# EAGLE design Logic Engine - Front SK6812 (EAGLE 6.6.0)
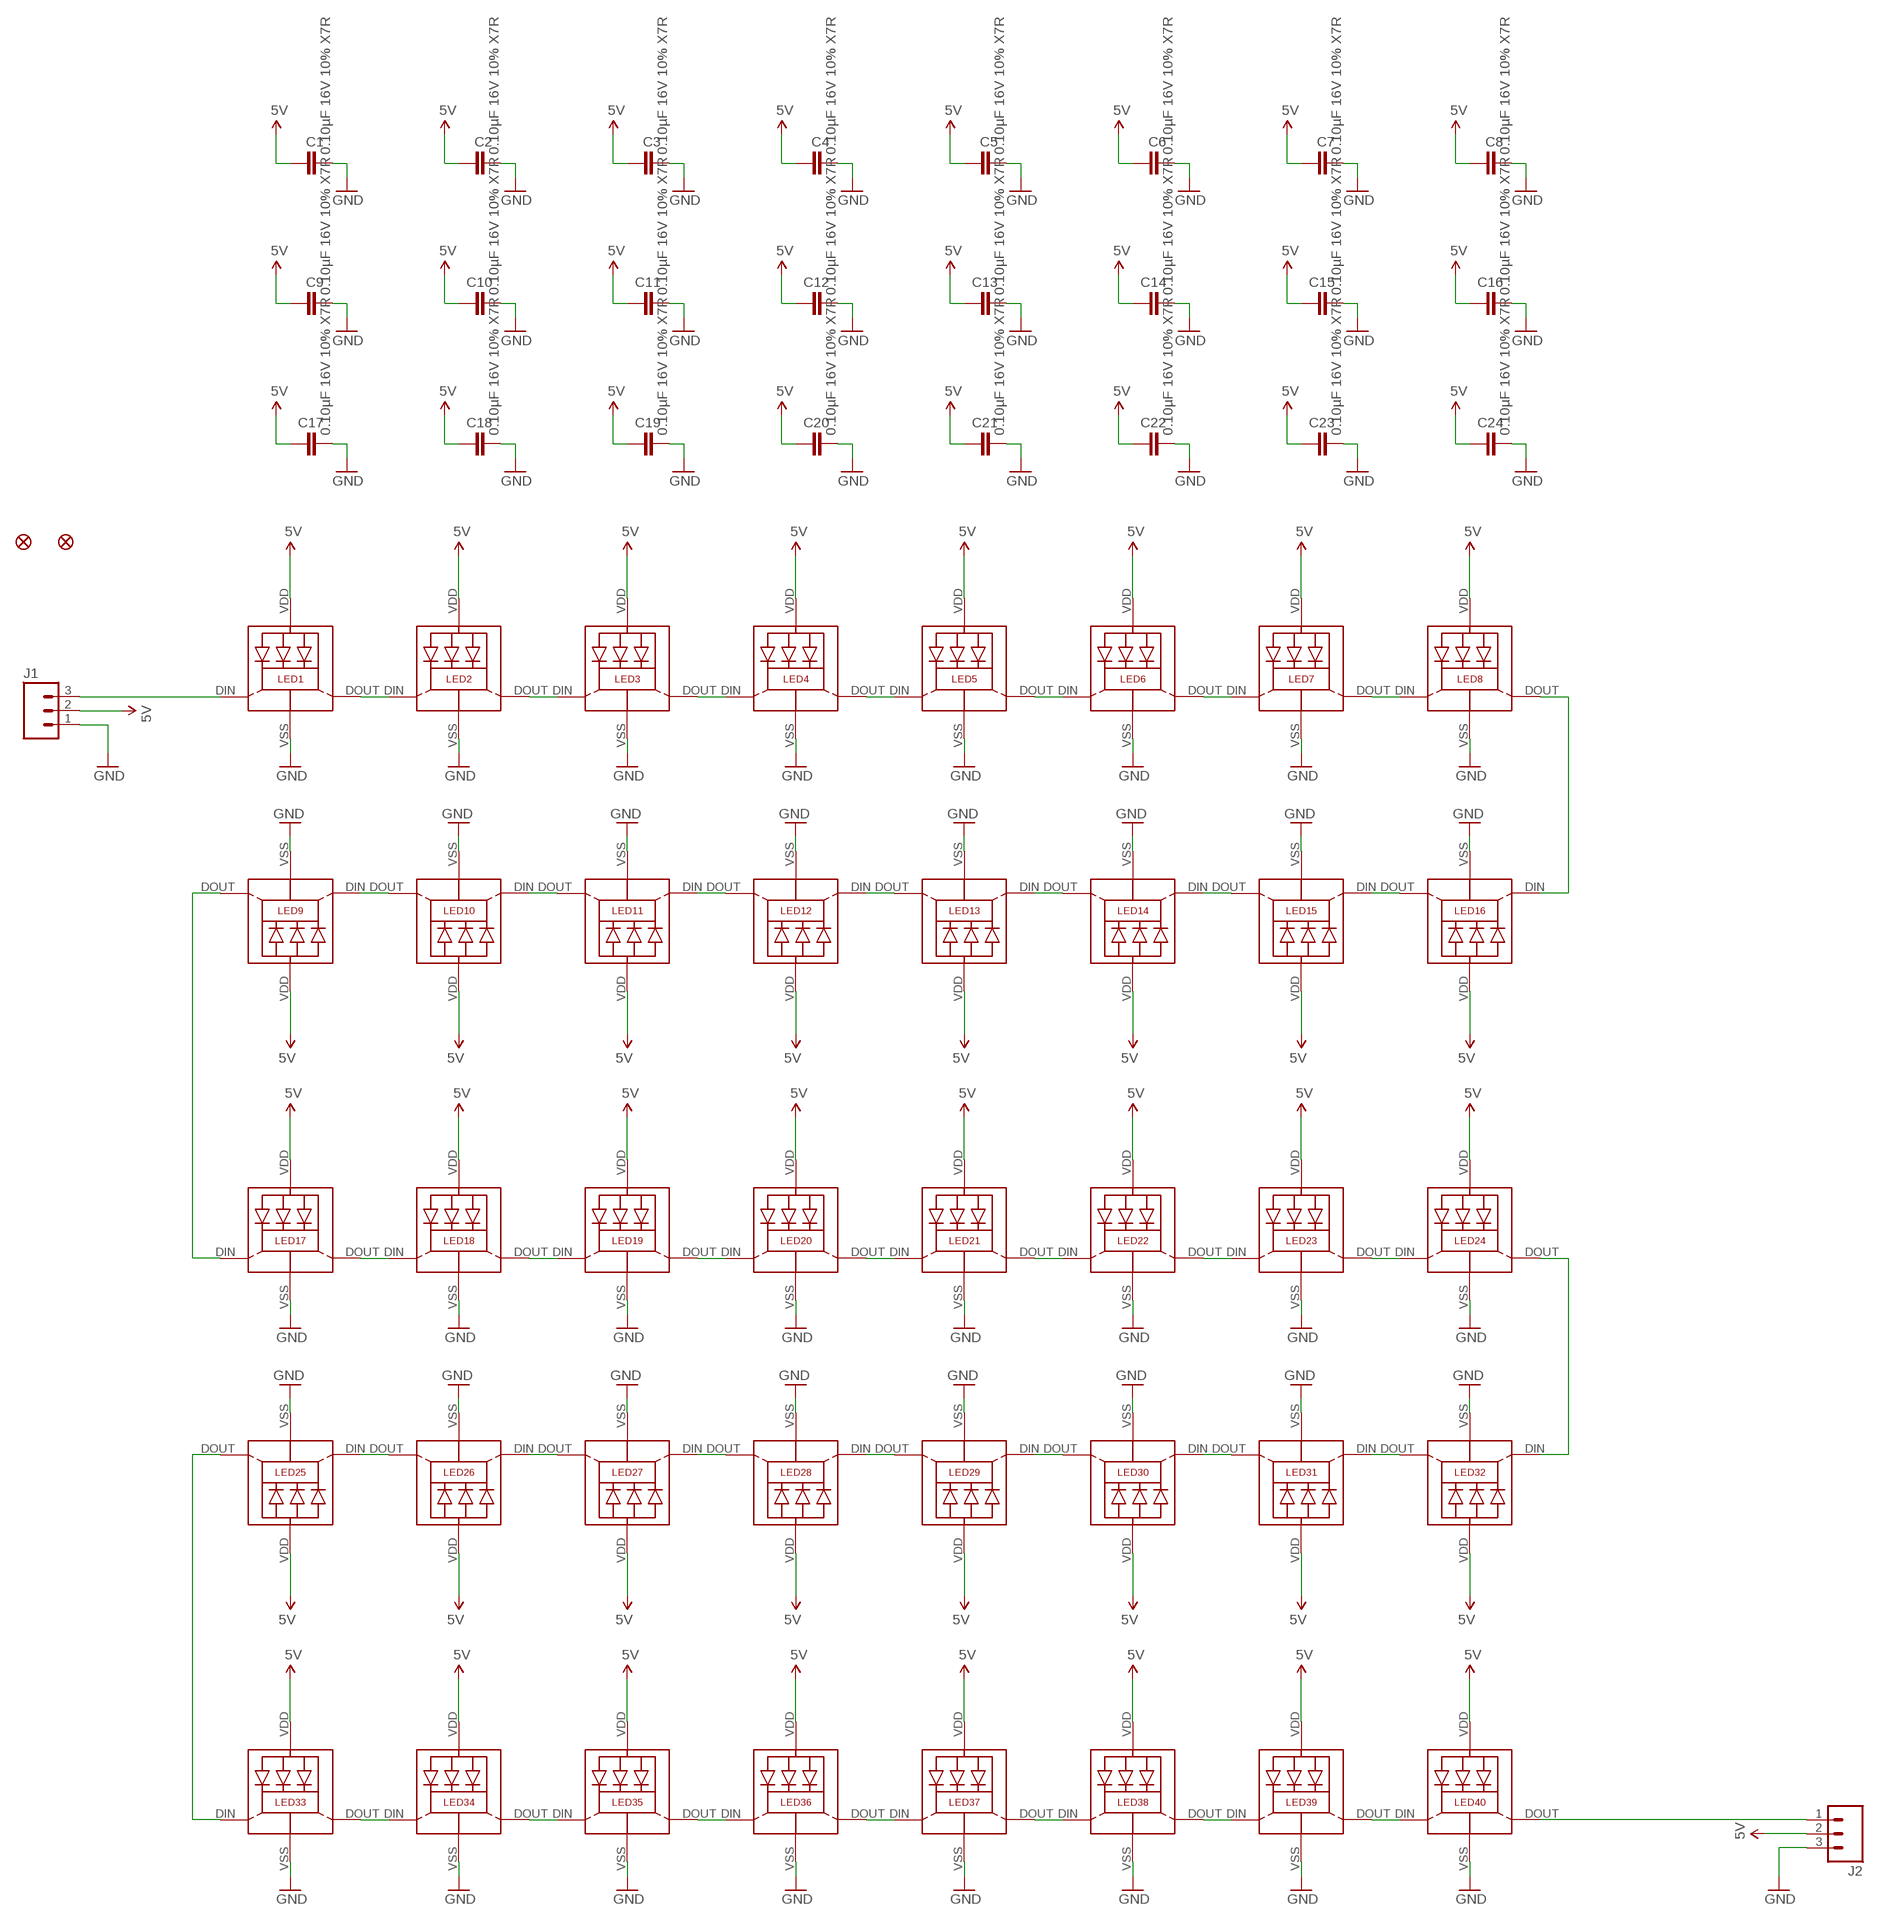
[diagram p0: schematic, sheet 1]

## Parts
C1  0.10µF 16V 10% X7R  C-EUC0603  [C0603]
C2  0.10µF 16V 10% X7R  C-EUC0603  [C0603]
C3  0.10µF 16V 10% X7R  C-EUC0603  [C0603]
C4  0.10µF 16V 10% X7R  C-EUC0603  [C0603]
C5  0.10µF 16V 10% X7R  C-EUC0603  [C0603]
C6  0.10µF 16V 10% X7R  C-EUC0603  [C0603]
C7  0.10µF 16V 10% X7R  C-EUC0603  [C0603]
C8  0.10µF 16V 10% X7R  C-EUC0603  [C0603]
C9  0.10µF 16V 10% X7R  C-EUC0603  [C0603]
C10  0.10µF 16V 10% X7R  C-EUC0603  [C0603]
C11  0.10µF 16V 10% X7R  C-EUC0603  [C0603]
C12  0.10µF 16V 10% X7R  C-EUC0603  [C0603]
C13  0.10µF 16V 10% X7R  C-EUC0603  [C0603]
C14  0.10µF 16V 10% X7R  C-EUC0603  [C0603]
C15  0.10µF 16V 10% X7R  C-EUC0603  [C0603]
C16  0.10µF 16V 10% X7R  C-EUC0603  [C0603]
C17  0.10µF 16V 10% X7R  C-EUC0603  [C0603]
C18  0.10µF 16V 10% X7R  C-EUC0603  [C0603]
C19  0.10µF 16V 10% X7R  C-EUC0603  [C0603]
C20  0.10µF 16V 10% X7R  C-EUC0603  [C0603]
C21  0.10µF 16V 10% X7R  C-EUC0603  [C0603]
C22  0.10µF 16V 10% X7R  C-EUC0603  [C0603]
C23  0.10µF 16V 10% X7R  C-EUC0603  [C0603]
C24  0.10µF 16V 10% X7R  C-EUC0603  [C0603]
FD1  FIDUCIAL1X2  [FIDUCIAL-1X2]
FD2  FIDUCIAL1X2  [FIDUCIAL-1X2]
J1  M03PTH  [1X03]
J2  M03PTH  [1X03]
LED1  WS2812BSK6812MINI  [SK6812MINI]
LED2  WS2812BSK6812MINI  [SK6812MINI]
LED3  WS2812BSK6812MINI  [SK6812MINI]
LED4  WS2812BSK6812MINI  [SK6812MINI]
LED5  WS2812BSK6812MINI  [SK6812MINI]
LED6  WS2812BSK6812MINI  [SK6812MINI]
LED7  WS2812BSK6812MINI  [SK6812MINI]
LED8  WS2812BSK6812MINI  [SK6812MINI]
LED9  WS2812BSK6812MINI  [SK6812MINI]
LED10  WS2812BSK6812MINI  [SK6812MINI]
LED11  WS2812BSK6812MINI  [SK6812MINI]
LED12  WS2812BSK6812MINI  [SK6812MINI]
LED13  WS2812BSK6812MINI  [SK6812MINI]
LED14  WS2812BSK6812MINI  [SK6812MINI]
LED15  WS2812BSK6812MINI  [SK6812MINI]
LED16  WS2812BSK6812MINI  [SK6812MINI]
LED17  WS2812BSK6812MINI  [SK6812MINI]
LED18  WS2812BSK6812MINI  [SK6812MINI]
LED19  WS2812BSK6812MINI  [SK6812MINI]
LED20  WS2812BSK6812MINI  [SK6812MINI]
LED21  WS2812BSK6812MINI  [SK6812MINI]
LED22  WS2812BSK6812MINI  [SK6812MINI]
LED23  WS2812BSK6812MINI  [SK6812MINI]
LED24  WS2812BSK6812MINI  [SK6812MINI]
LED25  WS2812BSK6812MINI  [SK6812MINI]
LED26  WS2812BSK6812MINI  [SK6812MINI]
LED27  WS2812BSK6812MINI  [SK6812MINI]
LED28  WS2812BSK6812MINI  [SK6812MINI]
LED29  WS2812BSK6812MINI  [SK6812MINI]
LED30  WS2812BSK6812MINI  [SK6812MINI]
LED31  WS2812BSK6812MINI  [SK6812MINI]
LED32  WS2812BSK6812MINI  [SK6812MINI]
LED33  WS2812BSK6812MINI  [SK6812MINI]
LED34  WS2812BSK6812MINI  [SK6812MINI]
LED35  WS2812BSK6812MINI  [SK6812MINI]
LED36  WS2812BSK6812MINI  [SK6812MINI]
LED37  WS2812BSK6812MINI  [SK6812MINI]
LED38  WS2812BSK6812MINI  [SK6812MINI]
LED39  WS2812BSK6812MINI  [SK6812MINI]
LED40  WS2812BSK6812MINI  [SK6812MINI]

## Nets
5V: C1.1 C2.1 C3.1 C4.1 C5.1 C6.1 C7.1 C8.1 C9.1 C10.1 C11.1 C12.1 C13.1 C14.1 C15.1 C16.1 C17.1 C18.1 C19.1 C20.1 C21.1 C22.1 C23.1 C24.1 J1.2 J2.2 LED1.VDD LED2.VDD LED3.VDD LED4.VDD LED5.VDD LED6.VDD LED7.VDD LED8.VDD LED9.VDD LED10.VDD LED11.VDD LED12.VDD LED13.VDD LED14.VDD LED15.VDD LED16.VDD LED17.VDD LED18.VDD LED19.VDD LED20.VDD LED21.VDD LED22.VDD LED23.VDD LED24.VDD LED25.VDD LED26.VDD LED27.VDD LED28.VDD LED29.VDD LED30.VDD LED31.VDD LED32.VDD LED33.VDD LED34.VDD LED35.VDD LED36.VDD LED37.VDD LED38.VDD LED39.VDD LED40.VDD
GND: C1.2 C2.2 C3.2 C4.2 C5.2 C6.2 C7.2 C8.2 C9.2 C10.2 C11.2 C12.2 C13.2 C14.2 C15.2 C16.2 C17.2 C18.2 C19.2 C20.2 C21.2 C22.2 C23.2 C24.2 J1.1 J2.3 LED1.VSS(GND) LED2.VSS(GND) LED3.VSS(GND) LED4.VSS(GND) LED5.VSS(GND) LED6.VSS(GND) LED7.VSS(GND) LED8.VSS(GND) LED9.VSS(GND) LED10.VSS(GND) LED11.VSS(GND) LED12.VSS(GND) LED13.VSS(GND) LED14.VSS(GND) LED15.VSS(GND) LED16.VSS(GND) LED17.VSS(GND) LED18.VSS(GND) LED19.VSS(GND) LED20.VSS(GND) LED21.VSS(GND) LED22.VSS(GND) LED23.VSS(GND) LED24.VSS(GND) LED25.VSS(GND) LED26.VSS(GND) LED27.VSS(GND) LED28.VSS(GND) LED29.VSS(GND) LED30.VSS(GND) LED31.VSS(GND) LED32.VSS(GND) LED33.VSS(GND) LED34.VSS(GND) LED35.VSS(GND) LED36.VSS(GND) LED37.VSS(GND) LED38.VSS(GND) LED39.VSS(GND) LED40.VSS(GND)
N$1: LED1.DOUT(DO) LED2.DIN(DI)
N$2: LED2.DOUT(DO) LED3.DIN(DI)
N$3: LED3.DOUT(DO) LED4.DIN(DI)
N$4: LED4.DOUT(DO) LED5.DIN(DI)
N$5: LED5.DOUT(DO) LED6.DIN(DI)
N$6: LED6.DOUT(DO) LED7.DIN(DI)
N$7: LED7.DOUT(DO) LED8.DIN(DI)
N$8: LED8.DOUT(DO) LED16.DIN(DI)
N$10: LED15.DIN(DI) LED16.DOUT(DO)
N$11: LED14.DIN(DI) LED15.DOUT(DO)
N$12: LED13.DIN(DI) LED14.DOUT(DO)
N$13: LED12.DIN(DI) LED13.DOUT(DO)
N$14: LED11.DIN(DI) LED12.DOUT(DO)
N$15: LED10.DIN(DI) LED11.DOUT(DO)
N$16: LED9.DIN(DI) LED10.DOUT(DO)
N$17: LED17.DOUT(DO) LED18.DIN(DI)
N$18: LED18.DOUT(DO) LED19.DIN(DI)
N$19: LED19.DOUT(DO) LED20.DIN(DI)
N$20: LED20.DOUT(DO) LED21.DIN(DI)
N$21: LED21.DOUT(DO) LED22.DIN(DI)
N$22: LED22.DOUT(DO) LED23.DIN(DI)
N$23: LED23.DOUT(DO) LED24.DIN(DI)
N$24: LED24.DOUT(DO) LED32.DIN(DI)
N$25: J2.1 LED40.DOUT(DO)
N$27: LED9.DOUT(DO) LED17.DIN(DI)
N$29: LED31.DIN(DI) LED32.DOUT(DO)
N$30: LED30.DIN(DI) LED31.DOUT(DO)
N$31: LED29.DIN(DI) LED30.DOUT(DO)
N$32: LED28.DIN(DI) LED29.DOUT(DO)
N$33: LED27.DIN(DI) LED28.DOUT(DO)
N$34: LED26.DIN(DI) LED27.DOUT(DO)
N$35: LED25.DIN(DI) LED26.DOUT(DO)
N$36: LED33.DOUT(DO) LED34.DIN(DI)
N$37: LED34.DOUT(DO) LED35.DIN(DI)
N$38: LED35.DOUT(DO) LED36.DIN(DI)
N$39: LED36.DOUT(DO) LED37.DIN(DI)
N$40: LED37.DOUT(DO) LED38.DIN(DI)
N$41: LED38.DOUT(DO) LED39.DIN(DI)
N$42: LED39.DOUT(DO) LED40.DIN(DI)
N$44: LED25.DOUT(DO) LED33.DIN(DI)
N$47: J1.3 LED1.DIN(DI)

## Library data of the parts
C1-C24 = rcl:C-EU: CAPACITOR, European symbol
FD1 FD2 = SparkFun-Aesthetics:FIDUCIAL: Fiducial Alignment Points Various fiducial points for machine vision alignment.
J1 J2 = SparkFun-Connectors:M03: Header 3 Standard 3-pin 0.1" header. Use with straight break away headers (SKU : PRT-00116), right angle break away headers (PRT-00553), swiss pins (PRT-00743), machine pins (PRT-00117), and female headers (PRT-00115). Molex polarized connector foot print use with SKU : PRT-08232 with associated crimp pins and housings.
LED1-LED40 = rseries:WS2812B: WS2812B is the 4-pin variant of the WS2812 http://www.mikrocontroller.net/attachment/180459/WS2812B_preliminary.pdf based on WS2812 from https://github.com/adafruit/Adafruit-Eagle-Library

## Board
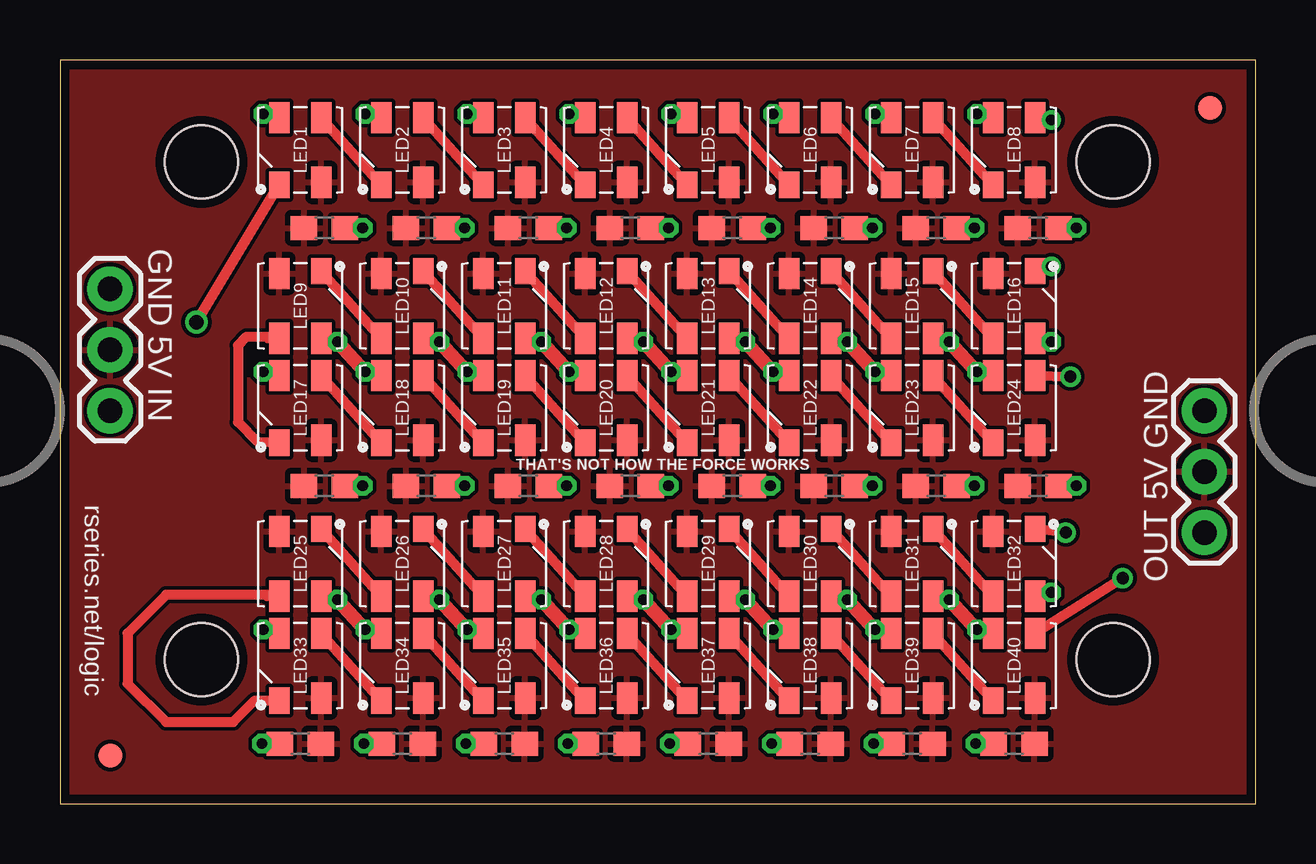
[diagram p1: board, top side]
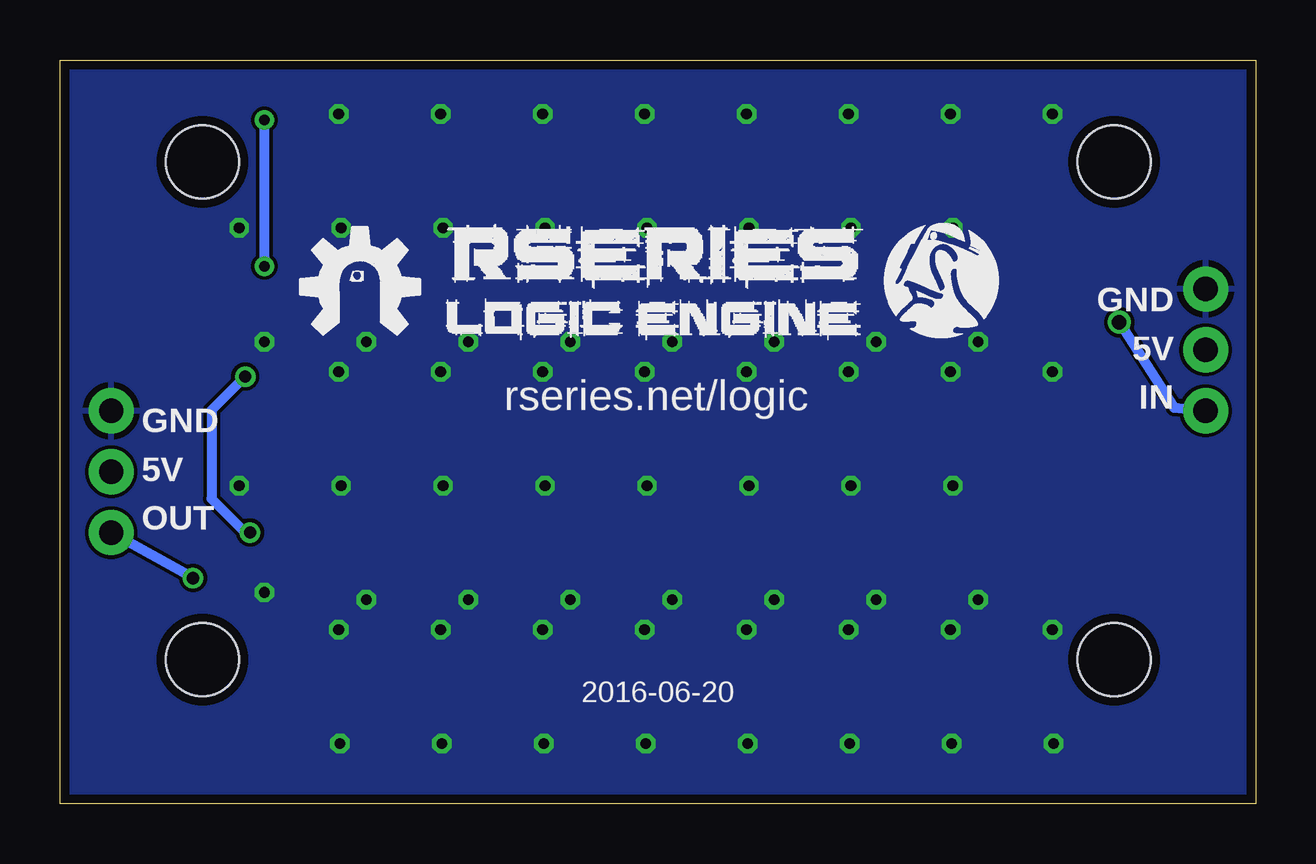
[diagram p2: board, bottom side, seen from below]

Size 49.84 x 31 mm. Coordinates in mm from the lower left corner, seen from the top.
Outline: 0,0 49.84,0 49.84,31 0,31 0,0
Copper layers (1*16): Top 0.0356mm / dielectric 1.5011mm / Bottom 0.0356mm
Design rules "LaenPCBOrder *": minimum track width 8mil, minimum drill 13mil, track to track 6mil, track to pad 6mil, pad to pad 6mil, via to via 6mil, smd to smd 6mil, copper to edge 15mil, drill to drill 6mil, minimum pad ring 7mil, minimum via ring 7mil, stop-mask expansion 3mil, vias tented up to drill 20mil, thermal gap 10mil
Holes 3.05 mm at 5.89,6 43.89,6 5.89,26.75 43.89,26.75

### Footprints (pad centres in the part's own frame; a part is rotated, then mirrored left to right if it is on the bottom)
C0603 = smd 1.1 x 1: 1 -0.85,0; 2 0.85,0
FIDUCIAL-1X2 = smd 1 x 1: 1 0,0
1X03 = drill 1.016 pad 1.88: 1 0,0; 2 2.54,0; 3 5.08,0
SK6812MINI = smd 1.1 x 0.85: DIN 1.45,-0.875 | smd 1.3 x 0.85: DOUT -1.35,0.875; VDD 1.35,0.875; VSS -1.35,-0.875

### Placement (x,y rotation side)
C1  11.02,24 0 top
C2  15.27,24 0 top
C3  19.52,24 0 top
C4  23.77,24 0 top
C5  28.02,24 0 top
C6  32.27,24 0 top
C7  36.52,24 0 top
C8  40.77,24 0 top
C9  11.02,13.25 0 top
C10  15.27,13.25 0 top
C11  19.52,13.25 0 top
C12  23.77,13.25 0 top
C13  28.02,13.25 0 top
C14  32.27,13.25 0 top
C15  36.52,13.25 0 top
C16  40.77,13.25 0 top
C17  10.02,2.5 180 top
C18  14.27,2.5 180 top
C19  18.52,2.5 180 top
C20  22.77,2.5 180 top
C21  27.02,2.5 180 top
C22  31.27,2.5 180 top
C23  35.52,2.5 180 top
C24  39.77,2.5 180 top
FD1  2.1,2 0 top
FD2  47.94,29 0 top
J1  2.08,21.45 270 top
J2  47.7,11.29 90 top
LED1  10.02,27.25 270 top
LED2  14.27,27.25 270 top
LED3  18.52,27.25 270 top
LED4  22.77,27.25 270 top
LED5  27.02,27.25 270 top
LED6  31.27,27.25 270 top
LED7  35.52,27.25 270 top
LED8  39.77,27.25 270 top
LED9  10.02,20.75 90 top
LED10  14.27,20.75 90 top
LED11  18.52,20.75 90 top
LED12  22.77,20.75 90 top
LED13  27.02,20.75 90 top
LED14  31.27,20.75 90 top
LED15  35.52,20.75 90 top
LED16  39.77,20.75 90 top
LED17  10.02,16.5 270 top
LED18  14.27,16.5 270 top
LED19  18.52,16.5 270 top
LED20  22.77,16.5 270 top
LED21  27.02,16.5 270 top
LED22  31.27,16.5 270 top
LED23  35.52,16.5 270 top
LED24  39.77,16.5 270 top
LED25  10.02,10 90 top
LED26  14.27,10 90 top
LED27  18.52,10 90 top
LED28  22.77,10 90 top
LED29  27.02,10 90 top
LED30  31.27,10 90 top
LED31  35.52,10 90 top
LED32  39.77,10 90 top
LED33  10.02,5.75 270 top
LED34  14.27,5.75 270 top
LED35  18.52,5.75 270 top
LED36  22.77,5.75 270 top
LED37  27.02,5.75 270 top
LED38  31.27,5.75 270 top
LED39  35.52,5.75 270 top
LED40  39.77,5.75 270 top
U$1  [RSERIES-LE-LOGO]  34.14,18.8 0 bottom
U$2  [R2BUILDERS-LOGO]  15.59,19.3 0 bottom
U$3  [RSERIES-OSHW-LOGO-MEDIUM]  37.44,21.59 0 bottom

### Tracks (layer width: path | path; a pad name or v marks a point on that pad's centre or on a via)
5V
  pour Top: -13.98,47 58.02,47 58.02,-4 -13.98,-4
GND  (via drill 0.45)
  Top 0.406: v8.47,28.75 LED1.VSS | v12.72,28.75 LED2.VSS | v16.97,28.75 LED3.VSS | v21.22,28.75 LED4.VSS | v25.47,28.75 LED5.VSS | v29.72,28.75 LED6.VSS | v33.97,28.75 LED7.VSS | v38.22,28.75 LED8.VSS | v41.32,19.25 LED16.VSS | LED24.VSS v38.22,18 | LED15.VSS v37.07,19.25 | LED23.VSS v33.97,18 | LED14.VSS v32.82,19.25 | LED13.VSS v28.57,19.25 | LED22.VSS v29.72,18 | LED21.VSS v25.47,18 | LED12.VSS v24.32,19.25 | LED20.VSS v21.22,18 | LED11.VSS v20.07,19.25 | LED19.VSS v16.97,18 | LED10.VSS v15.82,19.25 | LED18.VSS v12.72,18 | LED9.VSS v11.57,19.25 | LED17.VSS v8.47,18 | LED25.VSS v11.57,8.5 | LED34.VSS v12.72,7.25 | LED26.VSS v15.82,8.5 | LED35.VSS v16.97,7.25 | LED27.VSS v20.07,8.5 | LED36.VSS v21.22,7.25 | LED28.VSS v24.32,8.5 | LED37.VSS v25.47,7.25 | LED29.VSS v28.57,8.5 | LED38.VSS v29.72,7.25 | LED30.VSS v32.82,8.5 | LED39.VSS v33.97,7.25 | LED31.VSS v37.07,8.5 | LED40.VSS v38.22,7.25 | LED32.VSS v41.32,8.8 | C1.2 v12.62,24 | C2.2 v16.87,24 | C3.2 v21.12,24 | C4.2 v25.37,24 | C5.2 v29.62,24 | C6.2 v33.87,24 | C7.2 v38.12,24 | C8.2 v42.37,24 | C16.2 v42.37,13.25 | C15.2 v38.12,13.25 | C14.2 v33.87,13.25 | C13.2 v29.62,13.25 | C12.2 v25.37,13.25 | C11.2 v21.12,13.25 | C10.2 v16.87,13.25 | C9.2 v12.62,13.25 | C17.2 v8.42,2.5 | C18.2 v12.67,2.5 | C19.2 v16.92,2.5 | C20.2 v21.17,2.5 | C21.2 v25.42,2.5 | C22.2 v29.67,2.5 | C23.2 v33.92,2.5 | C24.2 v38.17,2.5 | v8.47,7.25 LED33.VSS
  Top 0.61: v11.57,19.25 v12.72,18 | v16.97,18 v15.82,19.25 | v20.07,19.25 v21.22,18 | v24.32,19.25 v25.47,18 | v28.57,19.25 v29.72,18 | v32.82,19.25 v33.97,18 | v37.07,19.25 v38.22,18 | v38.22,7.25 v37.07,8.5 | v32.82,8.5 v33.97,7.25 | v28.57,8.5 v29.72,7.25 | v24.32,8.5 v25.47,7.25 | v20.07,8.5 v21.22,7.25 | v15.82,8.5 v16.97,7.25 | v11.57,8.5 v12.72,7.25
  pour Bottom: -12.6,46.02 60.44,46.02 60.44,-8.08 -12.6,-8.08
N$1
  Top 0.406: LED1.DOUT LED2.DIN
N$2
  Top 0.406: LED2.DOUT LED3.DIN
N$3
  Top 0.406: LED3.DOUT LED4.DIN
N$4
  Top 0.406: LED4.DOUT LED5.DIN
N$5
  Top 0.406: LED5.DOUT LED6.DIN
N$6
  Top 0.406: LED6.DOUT LED7.DIN
N$7
  Top 0.406: LED7.DOUT LED8.DIN
N$8  (via drill 0.45)
  Top 0.406: LED8.DOUT 41.22,28.6 v41.32,28.5 | v41.32,22.4 LED16.DIN
  Bottom 0.406: v41.32,28.5 v41.32,22.4
N$10
  Top 0.406: LED15.DIN LED16.DOUT
N$11
  Top 0.406: LED14.DIN LED15.DOUT
N$12
  Top 0.406: LED13.DIN LED14.DOUT
N$13
  Top 0.406: LED12.DIN LED13.DOUT
N$14
  Top 0.406: LED11.DIN LED12.DOUT
N$15
  Top 0.406: LED10.DIN LED11.DOUT
N$16
  Top 0.406: LED9.DIN LED10.DOUT
N$17
  Top 0.406: LED17.DOUT LED18.DIN
N$18
  Top 0.406: LED18.DOUT LED19.DIN
N$19
  Top 0.406: LED19.DOUT LED20.DIN
N$20
  Top 0.406: LED20.DOUT LED21.DIN
N$21
  Top 0.406: LED21.DOUT LED22.DIN
N$22
  Top 0.406: LED22.DOUT LED23.DIN
N$23
  Top 0.406: LED23.DOUT LED24.DIN
N$24  (via drill 0.5)
  Top 0.406: LED24.DOUT v42.12,17.8 | v41.92,11.3 LED32.DIN
  Bottom 0.406: v42.12,17.8 43.52,16.4 43.52,12.7 42.22,11.4 v41.92,11.3
N$25  (via drill 0.51)
  Top 0.406: LED40.DOUT v44.3,9.4
  Bottom 0.406: v44.3,9.4 J2.1
N$27
  Top 0.406: LED9.DOUT 8.67,19.4 8.67,19.45 7.77,19.45 7.42,19.1 7.42,15.9 8.22,15.1 LED17.DIN
N$29
  Top 0.406: LED31.DIN LED32.DOUT
N$30
  Top 0.406: LED30.DIN LED31.DOUT
N$31
  Top 0.406: LED29.DIN LED30.DOUT
N$32
  Top 0.406: LED28.DIN LED29.DOUT
N$33
  Top 0.406: LED27.DIN LED28.DOUT
N$34
  Top 0.406: LED26.DIN LED27.DOUT
N$35
  Top 0.406: LED25.DIN LED26.DOUT
N$36
  Top 0.406: LED33.DOUT LED34.DIN
N$37
  Top 0.406: LED34.DOUT LED35.DIN
N$38
  Top 0.406: LED35.DOUT LED36.DIN
N$39
  Top 0.406: LED36.DOUT LED37.DIN
N$40
  Top 0.406: LED37.DOUT LED38.DIN
N$41
  Top 0.406: LED38.DOUT LED39.DIN
N$42
  Top 0.406: LED39.DOUT LED40.DIN
N$44
  Top 0.406: LED25.DOUT 8.62,8.65 8.62,8.7 4.42,8.7 2.82,7.1 2.82,5 4.42,3.4 7.22,3.4 8.12,4.3 LED33.DIN
N$47  (via drill 0.6)
  Top 0.406: v5.69,20.07 LED1.DIN
  Bottom 0.406: v5.69,20.07 3.4,16.51 J1.3

### Text on the board
tPlace: GND 5V IN | THAT'S NOT HOW THE FORCE WORKS | OUT 5V GND | rseries.net/logic
bPlace: GND / 5V / IN | rseries.net/logic | GND / 5V / OUT | 2016-06-20